# Altium schematic sheet Top.SchDoc
size A4; SheetNumber: 1; SheetTotal: 9
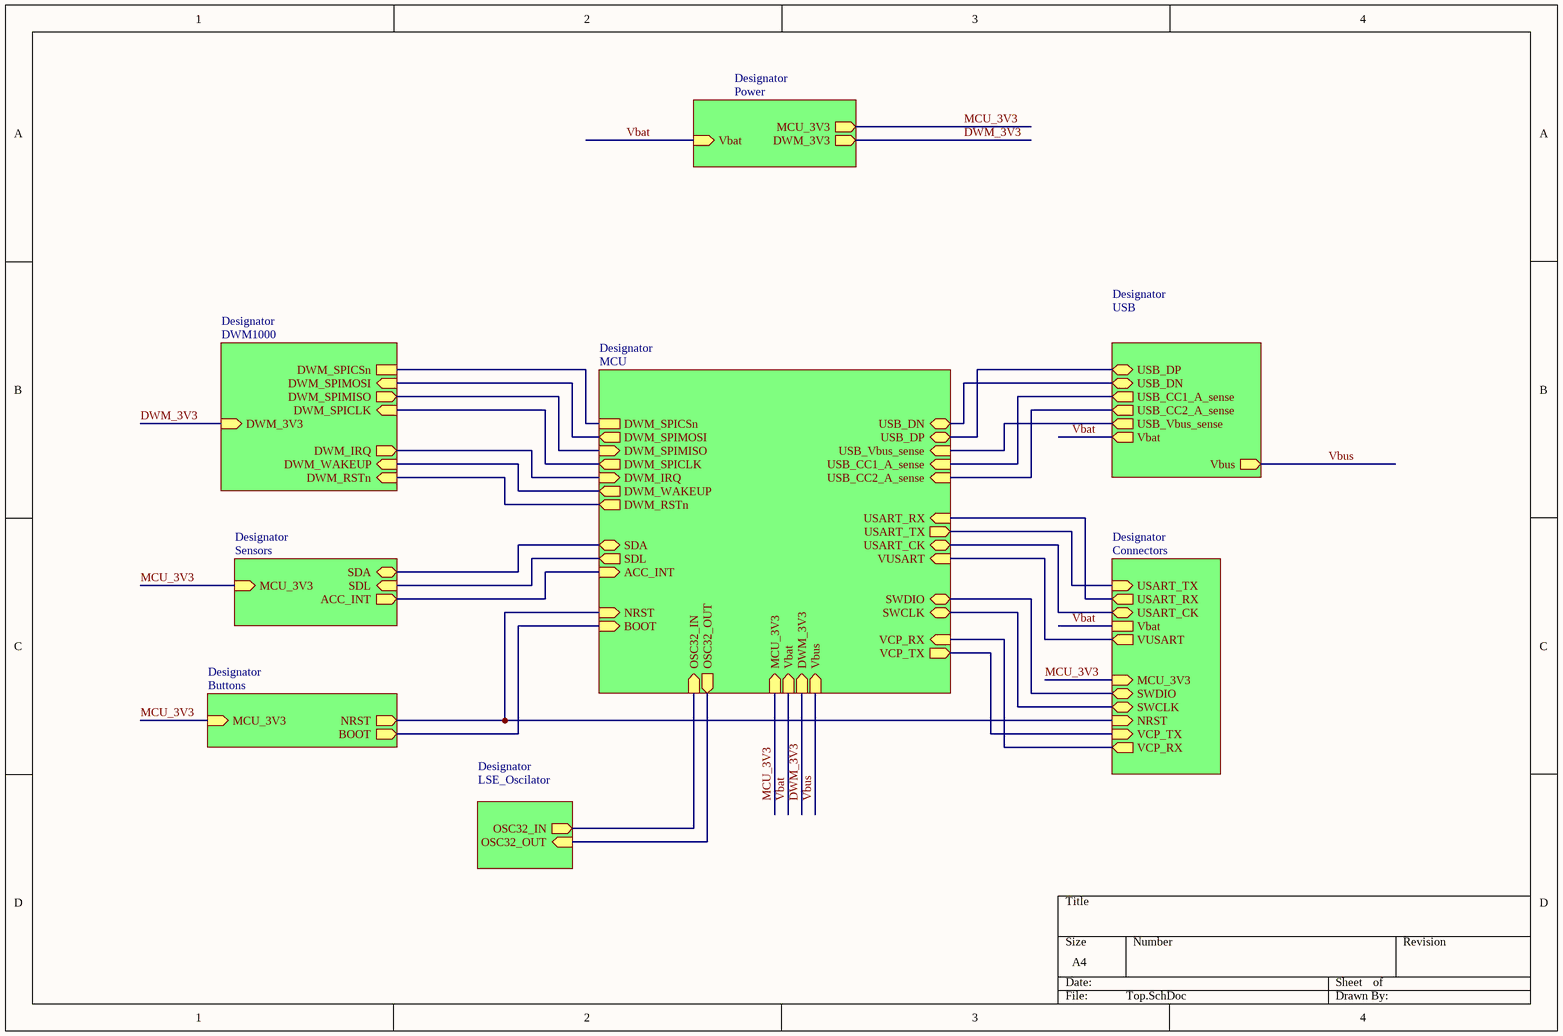
[diagram p0: Top.SchDoc]

## Sub-sheets
Designator = MCU: DWM_SPICSn, DWM_SPIMOSI (out), DWM_SPIMISO (in), DWM_SPICLK (out), DWM_IRQ (in), DWM_WAKEUP (out), DWM_RSTn (out), USB_DN (bidir), USB_DP (bidir), USB_Vbus_sense (in), USB_CC1_A_sense (in), USB_CC2_A_sense (in), USART_RX (in), USART_TX (out), USART_CK (bidir), VUSART (in), SWDIO (bidir), SWCLK (bidir), NRST (in), VCP_RX (in), VCP_TX (out), SDA (bidir), SDL (out), ACC_INT (in), BOOT (in), OSC32_IN (in), OSC32_OUT (out), MCU_3V3 (in), Vbat (in), DWM_3V3 (in), Vbus (in)
Designator = Power: MCU_3V3 (out), DWM_3V3 (out), Vbat (in)
Designator = LSE_Oscilator: OSC32_IN (out), OSC32_OUT (in)
Designator = USB: USB_DP (bidir), USB_DN (bidir), USB_CC1_A_sense (out), USB_CC2_A_sense (out), USB_Vbus_sense (out), Vbat (out), Vbus (out)
Designator = Connectors: USART_TX (in), USART_RX (out), USART_CK (bidir), Vbat, VUSART (out), MCU_3V3 (in), SWDIO (bidir), SWCLK (bidir), NRST (in), VCP_TX (in), VCP_RX (out)
Designator = Buttons: MCU_3V3 (in), NRST (out), BOOT (out)
Designator = DWM1000: DWM_SPICSn, DWM_SPIMOSI (in), DWM_SPIMISO (out), DWM_SPICLK (in), DWM_3V3 (in), DWM_IRQ (out), DWM_WAKEUP (in), DWM_RSTn (in)
Designator = Sensors: SDA (bidir), SDL (in), ACC_INT (out), MCU_3V3 (in)

## Nets
DWM_3V3: sheet Designator/DWM_3V3, sheet Designator/DWM_3V3, sheet Designator/DWM_3V3
MCU_3V3: sheet Designator/MCU_3V3, sheet Designator/MCU_3V3, sheet Designator/MCU_3V3, sheet Designator/MCU_3V3, sheet Designator/MCU_3V3
Vbat: sheet Designator/Vbat, sheet Designator/Vbat, sheet Designator/Vbat, sheet Designator/Vbat
Vbus: sheet Designator/Vbus, sheet Designator/Vbus
(unnamed): sheet Designator/DWM_SPICSn, sheet Designator/DWM_SPICSn
(unnamed): sheet Designator/DWM_SPIMOSI, sheet Designator/DWM_SPIMOSI
(unnamed): sheet Designator/DWM_SPIMISO, sheet Designator/DWM_SPIMISO
(unnamed): sheet Designator/DWM_SPICLK, sheet Designator/DWM_SPICLK
(unnamed): sheet Designator/DWM_IRQ, sheet Designator/DWM_IRQ
(unnamed): sheet Designator/DWM_WAKEUP, sheet Designator/DWM_WAKEUP
(unnamed): sheet Designator/DWM_RSTn, sheet Designator/DWM_RSTn
(unnamed): sheet Designator/USB_DN, sheet Designator/USB_DN
(unnamed): sheet Designator/USB_DP, sheet Designator/USB_DP
(unnamed): sheet Designator/USB_Vbus_sense, sheet Designator/USB_Vbus_sense
(unnamed): sheet Designator/USB_CC1_A_sense, sheet Designator/USB_CC1_A_sense
(unnamed): sheet Designator/USB_CC2_A_sense, sheet Designator/USB_CC2_A_sense
(unnamed): sheet Designator/USART_RX, sheet Designator/USART_RX
(unnamed): sheet Designator/USART_TX, sheet Designator/USART_TX
(unnamed): sheet Designator/USART_CK, sheet Designator/USART_CK
(unnamed): sheet Designator/VUSART, sheet Designator/VUSART
(unnamed): sheet Designator/SWDIO, sheet Designator/SWDIO
(unnamed): sheet Designator/SWCLK, sheet Designator/SWCLK
(unnamed): sheet Designator/NRST, sheet Designator/NRST, sheet Designator/NRST
(unnamed): sheet Designator/VCP_RX, sheet Designator/VCP_RX
(unnamed): sheet Designator/VCP_TX, sheet Designator/VCP_TX
(unnamed): sheet Designator/SDA, sheet Designator/SDA
(unnamed): sheet Designator/SDL, sheet Designator/SDL
(unnamed): sheet Designator/ACC_INT, sheet Designator/ACC_INT
(unnamed): sheet Designator/BOOT, sheet Designator/BOOT
(unnamed): sheet Designator/OSC32_IN, sheet Designator/OSC32_IN
(unnamed): sheet Designator/OSC32_OUT, sheet Designator/OSC32_OUT